# EAGLE schematic TOP (EAGLE 9.6.2)
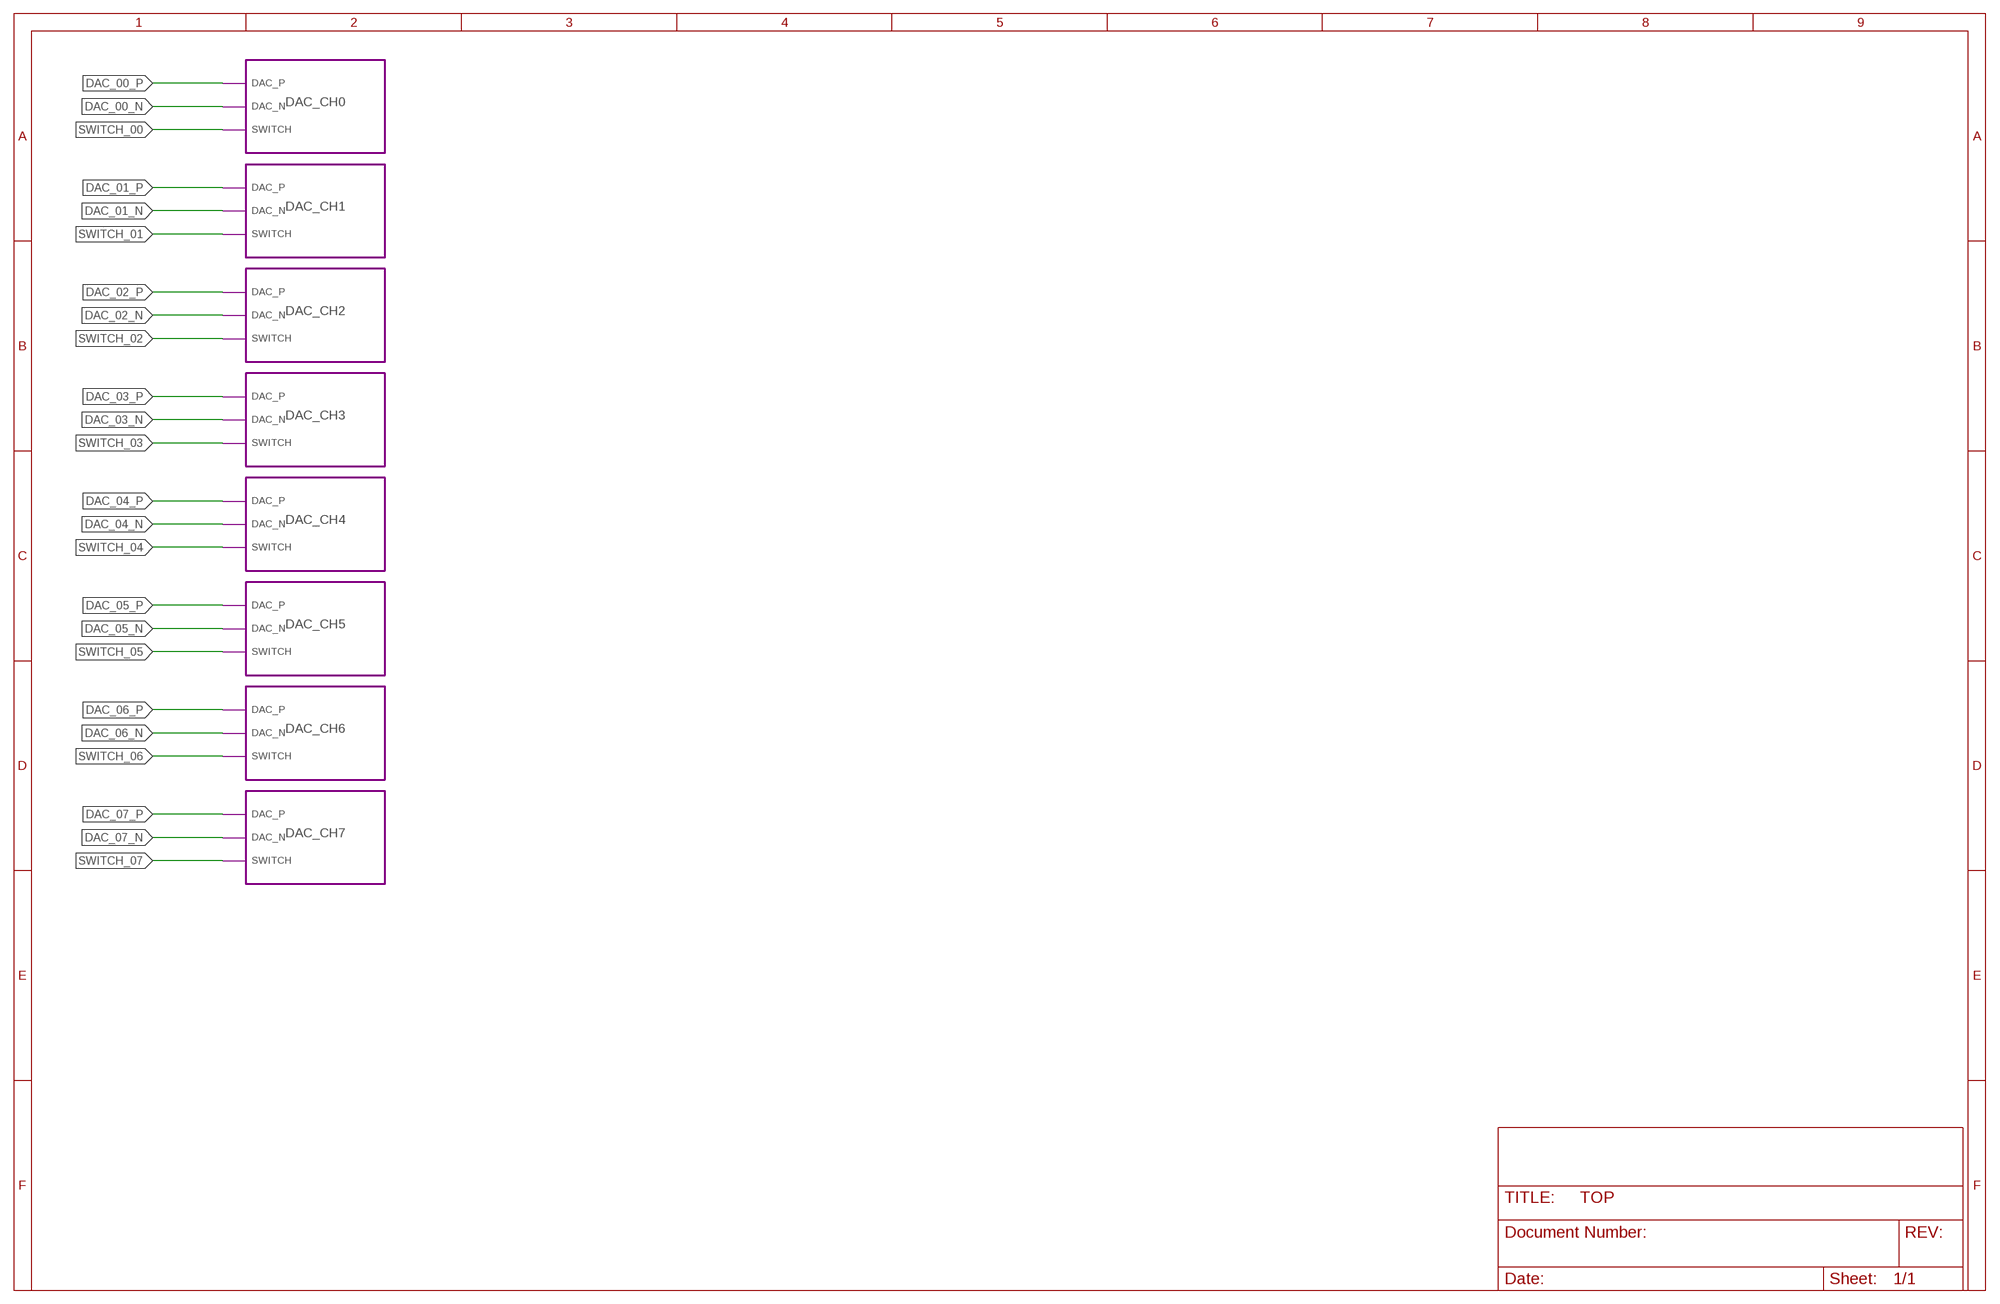
[diagram p0: schematic, sheet 1]

## Module instances
DAC_CH0 = DAC_CH
DAC_CH1 = DAC_CH
DAC_CH2 = DAC_CH
DAC_CH3 = DAC_CH
DAC_CH4 = DAC_CH
DAC_CH5 = DAC_CH
DAC_CH6 = DAC_CH
DAC_CH7 = DAC_CH

## Nets
DAC_00_N: port DAC_CH0.DAC_N
DAC_00_P: port DAC_CH0.DAC_P
DAC_01_N: port DAC_CH1.DAC_N
DAC_01_P: port DAC_CH1.DAC_P
DAC_02_N: port DAC_CH2.DAC_N
DAC_02_P: port DAC_CH2.DAC_P
DAC_03_N: port DAC_CH3.DAC_N
DAC_03_P: port DAC_CH3.DAC_P
DAC_04_N: port DAC_CH4.DAC_N
DAC_04_P: port DAC_CH4.DAC_P
DAC_05_N: port DAC_CH5.DAC_N
DAC_05_P: port DAC_CH5.DAC_P
DAC_06_N: port DAC_CH6.DAC_N
DAC_06_P: port DAC_CH6.DAC_P
DAC_07_N: port DAC_CH7.DAC_N
DAC_07_P: port DAC_CH7.DAC_P
SWITCH_00: port DAC_CH0.SWITCH
SWITCH_01: port DAC_CH1.SWITCH
SWITCH_02: port DAC_CH2.SWITCH
SWITCH_03: port DAC_CH3.SWITCH
SWITCH_04: port DAC_CH4.SWITCH
SWITCH_05: port DAC_CH5.SWITCH
SWITCH_06: port DAC_CH6.SWITCH
SWITCH_07: port DAC_CH7.SWITCH

## Library data of the parts

## Module DAC_CH
Ports: DAC_N(io) DAC_P(io) SWITCH(io)
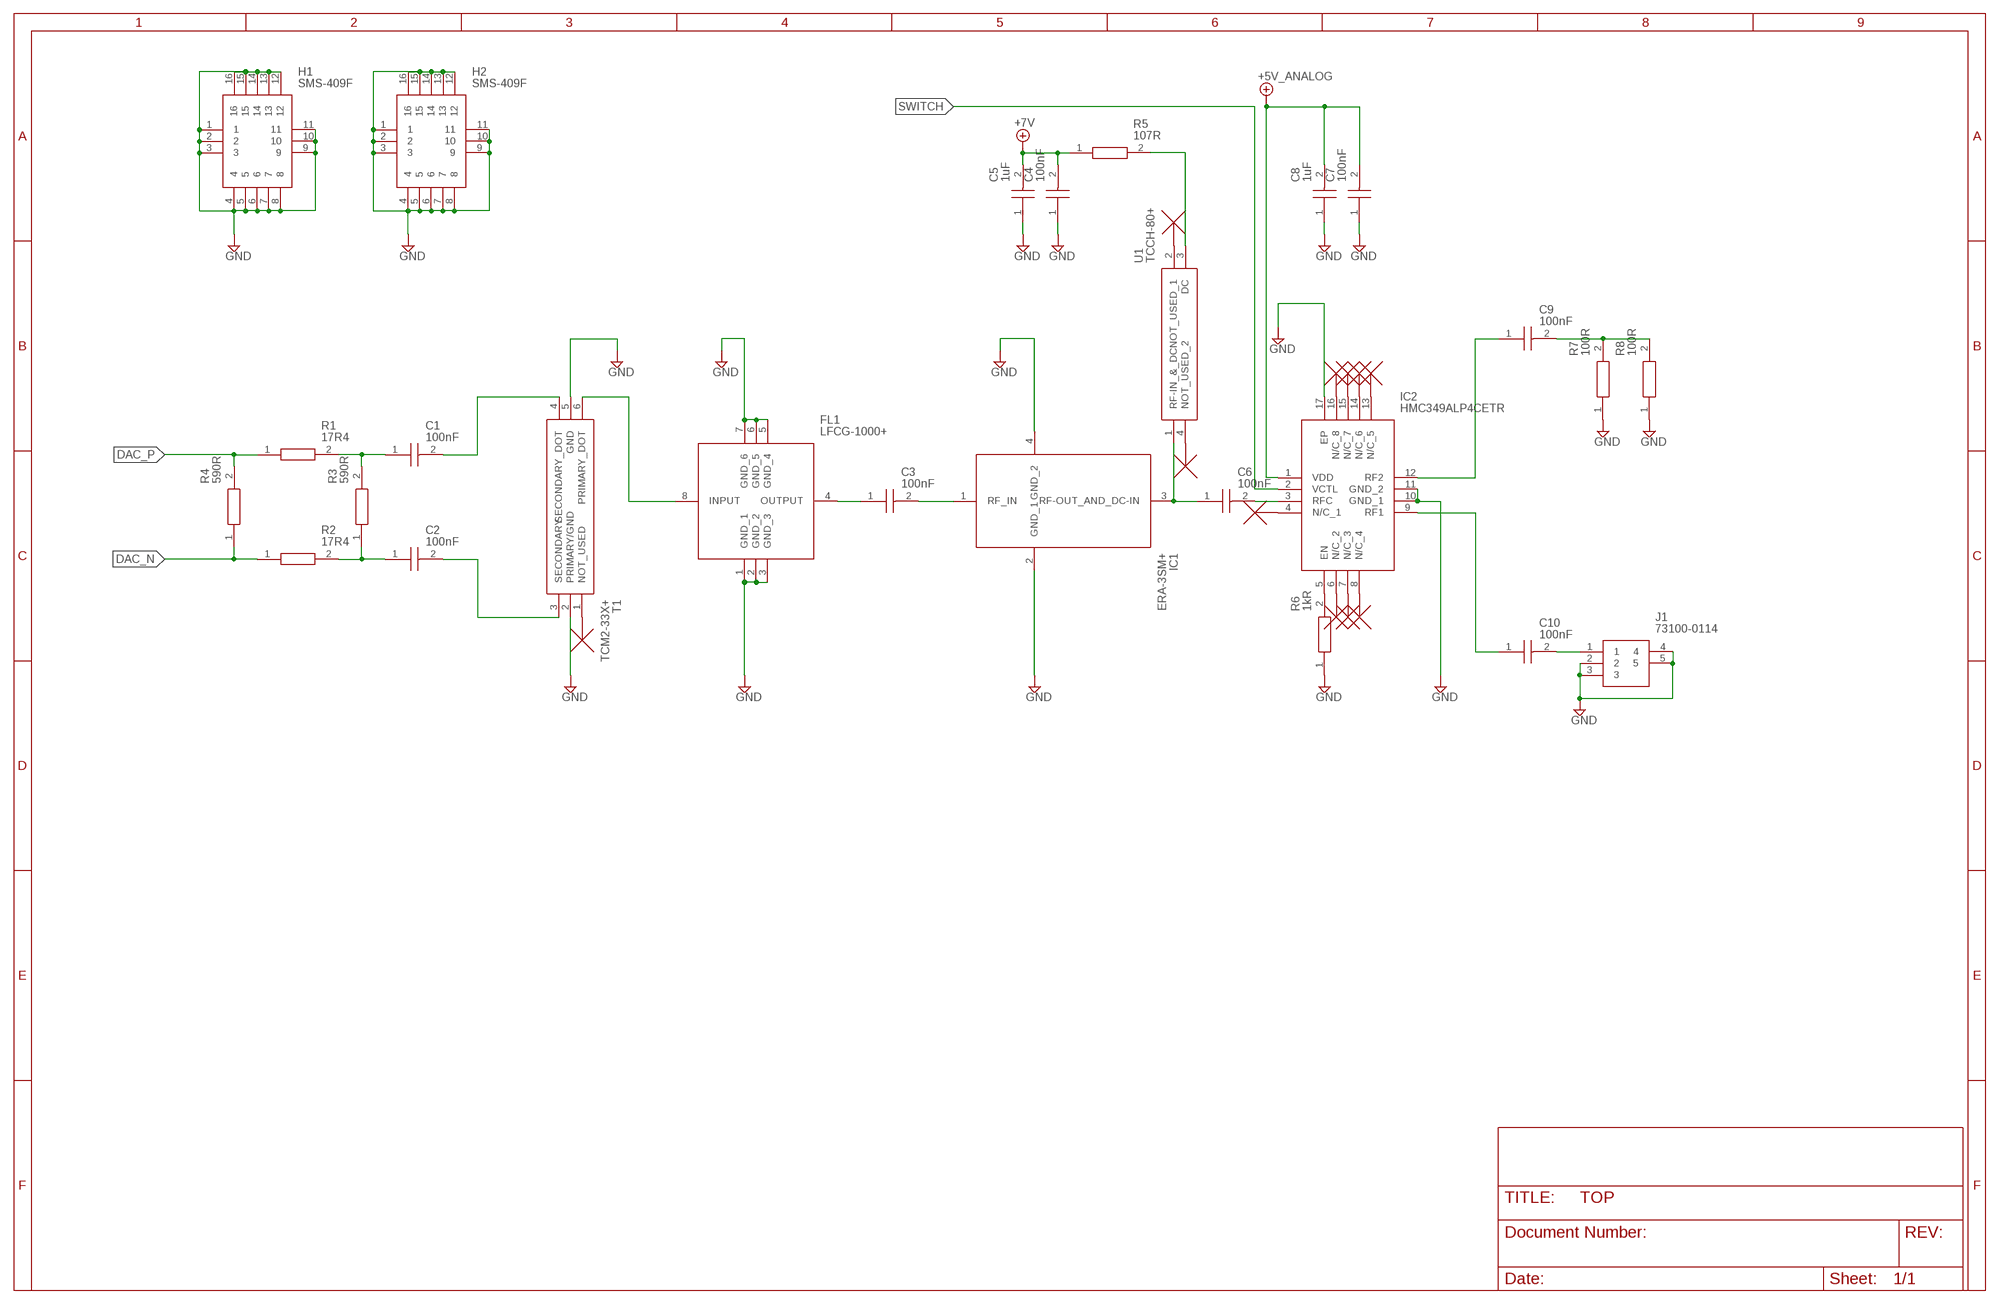
[diagram p1: schematic, module DAC_CH, sheet 1]

### Parts
C1  100nF  TMK105BJ104KV-F  [CAPC1005X55N]
C2  100nF  TMK105BJ104KV-F  [CAPC1005X55N]
C3  100nF  TMK105BJ104KV-F  [CAPC1005X55N]
C4  100nF  TMK105BJ104KV-F  [CAPC1005X55N]
C5  1uF  TMK105AC6105KV-F  [CAPC1005X60N]
C6  100nF  TMK105BJ104KV-F  [CAPC1005X55N]
C7  100nF  TMK105BJ104KV-F  [CAPC1005X55N]
C8  1uF  TMK105AC6105KV-F  [CAPC1005X60N]
C9  100nF  TMK105BJ104KV-F  [CAPC1005X55N]
C10  100nF  TMK105BJ104KV-F  [CAPC1005X55N]
FL1  LFCG-1000+  [LFCG1000]
H1  SMS-409F  [SMS409F]
H2  SMS-409F  [SMS409F]
IC1  ERA-3SM+  [ERA3SM]
IC2  HMC349ALP4CETR  [QFN65P400X400X100-17N]
J1  73100-0114  [731000114]
R1  17R4  ERJ2RKF17R4X  [ERJ2RKD1004X]
R2  17R4  ERJ2RKF17R4X  [ERJ2RKD1004X]
R3  590R  ERJ2RKF5900X  [ERJ2RKD1004X]
R4  590R  ERJ2RKF5900X  [ERJ2RKD1004X]
R5  107R  ERJ2RKF1070X  [ERJ2RKD1004X]
R6  1kR  ERJ-2RKF1001X  [ERJ2RKD1004X]
R7  100R  ERJ-2RKF1000X  [ERJ2RKD1004X]
R8  100R  ERJ-2RKF1000X  [ERJ2RKD1004X]
T1  TCM2-33X+  [TCM233X]
U1  TCCH-80+  [TCCH80]
U$1  NC_MARKER  (no package)
U$2  NC_MARKER  (no package)
U$3  NC_MARKER  (no package)
U$4  NC_MARKER  (no package)
U$5  NC_MARKER  (no package)
U$6  NC_MARKER  (no package)
U$7  NC_MARKER  (no package)
U$8  NC_MARKER  (no package)
U$9  NC_MARKER  (no package)
U$10  NC_MARKER  (no package)
U$11  NC_MARKER  (no package)

### Nets
+5V: C7.2 C8.2 IC2.1(VDD) ; supply symbol labelled +5V_ANALOG
+7V: C4.2 C5.2 R5.1
DAC_N: R2.1 R4.1
DAC_P: R1.1 R4.2
GND: C4.1 C5.1 C7.1 C8.1 FL1.1(GND_1) FL1.2(GND_2) FL1.3(GND_3) FL1.5(GND_4) FL1.6(GND_5) FL1.7(GND_6) H1.1 H1.2 H1.3 H1.4 H1.5 H1.6 H1.7 H1.8 H1.9 H1.10 H1.11 H1.12 H1.13 H1.14 H1.15 H1.16 H2.1 H2.2 H2.3 H2.4 H2.5 H2.6 H2.7 H2.8 H2.9 H2.10 H2.11 H2.12 H2.13 H2.14 H2.15 H2.16 IC1.2(GND_1) IC1.4(GND_2) IC2.10(GND_1) IC2.11(GND_2) IC2.17(EP) J1.2 J1.3 J1.4 J1.5 R6.1 R7.1 R8.1 T1.2(PRIMARY/GND) T1.5(GND)
N$1: C6.2 IC2.3(RFC)
N$2: C2.1 R2.2 R3.1
N$3: C1.1 R1.2 R3.2
N$4: IC2.6(N/C_2) U$4.P$1
N$5: T1.1(NOT_USED) U$1.P$1
N$6: C1.2 T1.4(SECONDARY_DOT)
N$7: C2.2 T1.3(SECONDARY)
N$8: FL1.8(INPUT) T1.6(PRIMARY_DOT)
N$9: C3.1 FL1.4(OUTPUT)
N$10: C3.2 IC1.1(RF_IN)
N$11: C6.1 IC1.3(RF-OUT_AND_DC-IN) U1.1(RF-IN_&_DC)
N$12: U1.4(NOT_USED_2) U$2.P$1
N$13: U1.2(NOT_USED_1) U$3.P$1
N$14: R5.2 U1.3(DC)
N$15: IC2.7(N/C_3) U$5.P$1
N$16: IC2.8(N/C_4) U$6.P$1
N$17: IC2.5(EN) R6.2
N$18: IC2.16(N/C_8) U$7.P$1
N$19: IC2.15(N/C_7) U$8.P$1
N$20: IC2.14(N/C_6) U$9.P$1
N$21: IC2.13(N/C_5) U$10.P$1
N$22: C9.2 R7.2 R8.2
N$23: IC2.4(N/C_1) U$11.P$1
N$24: C10.1 IC2.9(RF1)
N$25: C9.1 IC2.12(RF2)
N$26: C10.2 J1.1
SWITCH: IC2.2(VCTL)

### Library data of the parts
C1-C4 C6 C7 C9 C10 = SamacSys_Parts:TMK105BJ104KV-F: Taiyo Yuden 0402 (1005M) 100nF Multilayer Ceramic Capacitor MLCC 25V dc +/-10% SMD TMK105BJ104KV-F Source: Datasheet <https://ds.yuden.co.jp/TYCOMPAS/ut/download?pn=LMK063BBJ474MPLF&fileType=CA>; DESCRIPTION: Taiyo Yuden 0402 (1005M) 100nF Multilayer Ceramic Capacitor MLCC 25V dc +/-10% SMD TMK105BJ104KV-F; HEIGHT: 0.55mm; MANUFACTURER_NAME: TAIYO YUDEN; MANUFACTURER_PART_NUMBER: TMK105BJ104KV-F; MOUSER_PART_NUMBER: 963-TMK105BJ104KV-F; MOUSER_PRICE-STOCK: https://www.mouser.co.uk/ProductDetail/TAIYO-YUDEN/TMK105BJ104KV-F?qs=PzICbMaShUcuRhf9Ji%2F5mA%3D%3D
C5 C8 = SamacSys_Parts:TMK105AC6105KV-F: 0402 (1005M) 1uF MLCC 25V dc +/-10% SMD TMK105AC6105KV-F Source: Datasheet <https://componentsearchengine.com/Datasheets/2/TMK105AC6105KV-F.pdf>; DESCRIPTION: 0402 (1005M) 1uF MLCC 25V dc +/-10% SMD TMK105AC6105KV-F; HEIGHT: 0.6mm; MANUFACTURER_NAME: TAIYO YUDEN; MANUFACTURER_PART_NUMBER: TMK105AC6105KV-F; MOUSER_PART_NUMBER: 963-TMK105AC6105KV-F; MOUSER_PRICE-STOCK: https://www.mouser.co.uk/ProductDetail/Taiyo-Yuden/TMK105AC6105KV-F?qs=VWNNG7jHlrK4QAsTUyZliw%3D%3D
FL1 = SamacSys_Parts:LFCG-1000+: LTCC Low Pass Filter, DC - 1000 MHz, 50 Source: Datasheet <dlshin@tescomwireless.com>; DESCRIPTION: LTCC Low Pass Filter, DC - 1000 MHz, 50; HEIGHT: 0.95mm; MANUFACTURER_NAME: Mini-Circuits; MANUFACTURER_PART_NUMBER: LFCG-1000+; MOUSER_PART_NUMBER: 139-LFCG-1000; MOUSER_PRICE-STOCK: https://www.mouser.co.uk/ProductDetail/Mini-Circuits/LFCG-1000%2b?qs=xZ%2FP%252Ba9zWqa9%2FBD5JEjVhQ%3D%3D
H1 H2 = SamacSys_Parts:SMS-409F: EMI Gaskets, Sheets, Absorbers & Shielding .728 x 1.156 x .276 SHIELD FRAME Source: Datasheet <https://leadertechinc.com/wp-content/uploads/2016/04/SMS-409-REV-A.pdf>; DESCRIPTION: EMI Gaskets, Sheets, Absorbers & Shielding .728 x 1.156 x .276 SHIELD FRAME; HEIGHT: 7.1374mm; MANUFACTURER_NAME: Leader Tech Inc.; MANUFACTURER_PART_NUMBER: SMS-409F; MOUSER_PART_NUMBER: 861-SMS-409F; MOUSER_PRICE-STOCK: https://www.mouser.co.uk/ProductDetail/LeaderTech/SMS-409F?qs=Em4Ro3wiPJgc%2FfAAERmXkQ%3D%3D
IC1 = SamacSys_Parts:ERA-3SM+: Low Current MMIC Amplifier, DC to 3 GHz Source: Datasheet <https://www.minicircuits.com/WebStore/dashboard.html?model=ERA-3SM+>; DESCRIPTION: Low Current MMIC Amplifier, DC to 3 GHz; HEIGHT: 1.52mm; MANUFACTURER_NAME: Mini-Circuits; MANUFACTURER_PART_NUMBER: ERA-3SM+; MOUSER_PART_NUMBER: 139-ERA-3SM; MOUSER_PRICE-STOCK: https://www.mouser.co.uk/ProductDetail/Mini-Circuits/ERA-3SM%2b?qs=xZ%2FP%252Ba9zWqY4QiJxdjLZgw%3D%3D
IC2 = SamacSys_Parts:HMC349ALP4CETR: RF Switch ICs DC-4 GHZ Hi Isolation Switch Source: Datasheet <https://componentsearchengine.com/Datasheets/1/HMC349ALP4CETR.pdf>; ARROW_PART_NUMBER: HMC349ALP4CETR; ARROW_PRICE-STOCK: https://www.arrow.com/en/products/hmc349alp4cetr/analog-devices?region=nac; DESCRIPTION: RF Switch ICs DC-4 GHZ Hi Isolation Switch; HEIGHT: 1mm; MANUFACTURER_NAME: Analog Devices; MANUFACTURER_PART_NUMBER: HMC349ALP4CETR; MOUSER_PART_NUMBER: 584-HMC349ALP4CETR; MOUSER_PRICE-STOCK: https://www.mouser.co.uk/ProductDetail/Analog-Devices/HMC349ALP4CETR?qs=pceeu5JH%2FH95%252B5rl%2FahpoQ%3D%3D
J1 = SamacSys_Parts:73100-0114: RF Connectors / Coaxial Connectors RA JACK PCB Source: Datasheet <https://www.molex.com/pdm_docs/sd/731000114_sd.pdf>; ARROW_PART_NUMBER: 73100-0114; ARROW_PRICE-STOCK: https://www.arrow.com/en/products/73100-0114/molex?region=nac; DESCRIPTION: RF Connectors / Coaxial Connectors RA JACK PCB; HEIGHT: 9.57mm; MANUFACTURER_NAME: Molex; MANUFACTURER_PART_NUMBER: 73100-0114; MOUSER_PART_NUMBER: 538-73100-0114; MOUSER_PRICE-STOCK: https://www.mouser.co.uk/ProductDetail/Molex/73100-0114?qs=ohtcwxb5zIvxHEM9IPQ5cQ%3D%3D
R1 R2 = SamacSys_Parts:ERJ2RKF17R4X: PANASONIC - ERJ2RKF17R4X - SMD Chip Resistor, 0402 [1005 Metric], 17.4 ohm, ERJ2R Series, 50 V, Thick Film, 100 mW Source: Datasheet <http://docs-europe.electrocomponents.com/webdocs/13ba/0900766b813ba21b.pdf>; DESCRIPTION: PANASONIC - ERJ2RKF17R4X - SMD Chip Resistor, 0402 [1005 Metric], 17.4 ohm, ERJ2R Series, 50 V, Thick Film, 100 mW; HEIGHT: 0.4mm; MANUFACTURER_NAME: Panasonic; MANUFACTURER_PART_NUMBER: ERJ2RKF17R4X
R3 R4 = SamacSys_Parts:ERJ2RKF5900X: Panasonic ERJ2RK Series Precision Thick Film Surface Mount Resistor 0402 Case 590 +/-1% 0.1W +/-100ppm/C Source: Datasheet <http://docs-europe.electrocomponents.com/webdocs/13ba/0900766b813ba21b.pdf>; DESCRIPTION: Panasonic ERJ2RK Series Precision Thick Film Surface Mount Resistor 0402 Case 590 +/-1% 0.1W +/-100ppm/C; HEIGHT: 0.4mm; MANUFACTURER_NAME: Panasonic; MANUFACTURER_PART_NUMBER: ERJ2RKF5900X
R5 = SamacSys_Parts:ERJ2RKF1070X: Panasonic ERJ2RK Series Precision Thick Film Surface Mount Resistor 0402 Case 107 +/-1% 0.1W +/-100ppm/C Source: Datasheet <http://docs-europe.electrocomponents.com/webdocs/13ba/0900766b813ba21b.pdf>; DESCRIPTION: Panasonic ERJ2RK Series Precision Thick Film Surface Mount Resistor 0402 Case 107 +/-1% 0.1W +/-100ppm/C; HEIGHT: 0.4mm; MANUFACTURER_NAME: Panasonic; MANUFACTURER_PART_NUMBER: ERJ2RKF1070X
R6 = SamacSys_Parts:ERJ-2RKF1001X: Thick Film Resistors - SMD 0402 1Kohms 1% AEC-Q200 Source: Datasheet <https://industrial.panasonic.com/cdbs/www-data/pdf/RDA0000/AOA0000C86.pdf>; ARROW_PART_NUMBER: ERJ-2RKF1001X; ARROW_PRICE-STOCK: https://www.arrow.com/en/products/erj-2rkf1001x/panasonic?region=nac; DESCRIPTION: Thick Film Resistors - SMD 0402 1Kohms 1% AEC-Q200; HEIGHT: 0.4mm; MANUFACTURER_NAME: Panasonic; MANUFACTURER_PART_NUMBER: ERJ-2RKF1001X; MOUSER_PART_NUMBER: 667-ERJ-2RKF1001X; MOUSER_PRICE-STOCK: https://www.mouser.co.uk/ProductDetail/Panasonic/ERJ-2RKF1001X?qs=H7k1u0Mp9JRRg22R5LYj9Q%3D%3D
R7 R8 = SamacSys_Parts:ERJ-2RKF1000X: Precision Thick Film Chip Resistor, 0402, 0.063W Source: Datasheet <https://industrial.panasonic.com/cdbs/www-data/pdf/RDA0000/AOA0000C86.pdf>; ARROW_PART_NUMBER: ERJ-2RKF1000X; ARROW_PRICE-STOCK: https://www.arrow.com/en/products/erj-2rkf1000x/panasonic?region=europe; DESCRIPTION: Precision Thick Film Chip Resistor, 0402, 0.063W; HEIGHT: 0.4mm; MANUFACTURER_NAME: Panasonic; MANUFACTURER_PART_NUMBER: ERJ-2RKF1000X; MOUSER_PART_NUMBER: 667-ERJ-2RKF1000X; MOUSER_PRICE-STOCK: https://www.mouser.co.uk/ProductDetail/Panasonic/ERJ-2RKF1000X?qs=1iN9QGIZ5R%2Fx4uM9UolshQ%3D%3D
T1 = SamacSys_Parts:TCM2-33X+: Audio Transformers / Signal Transformers TC XFMR / SURF MT / HAT RoHS Source: Datasheet <https://www.minicircuits.com/pdfs/TCM2-33X .pdf>; DESCRIPTION: Audio Transformers / Signal Transformers TC XFMR / SURF MT / HAT RoHS; HEIGHT: 4.06mm; MANUFACTURER_NAME: Mini-Circuits; MANUFACTURER_PART_NUMBER: TCM2-33X+; MOUSER_PART_NUMBER: 139-TCM2-33X; MOUSER_PRICE-STOCK: https://www.mouser.co.uk/ProductDetail/Mini-Circuits/TCM2-33X%2b?qs=xZ%2FP%252Ba9zWqaG1YGshnyhGQ%3D%3D
U1 = SamacSys_Parts:TCCH-80+: RF Choke Source: Datasheet <https://www.minicircuits.com/pdfs/TCCH-80 .pdf>; DESCRIPTION: RF Choke; HEIGHT: 3.81mm; MANUFACTURER_NAME: Mini-Circuits; MANUFACTURER_PART_NUMBER: TCCH-80+; MOUSER_PART_NUMBER: 139-TCCH-80; MOUSER_PRICE-STOCK: https://www.mouser.co.uk/ProductDetail/Mini-Circuits/TCCH-80%2b?qs=xZ%2FP%252Ba9zWqbIZgt27nGgHg%3D%3D
U$1-U$11 = NC_MARKER:NC_MARKER